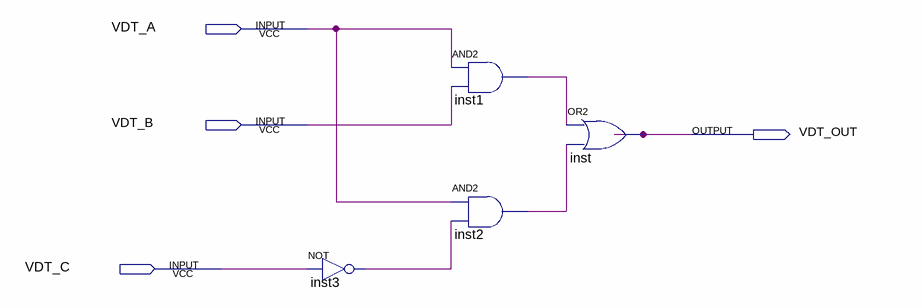
[diagram p0: schematic sheet]
// Quartus schematic assignment2b.bdf as structural Verilog: 4 symbols, 4 pins
module assignment2b (
  input  VDT_A,
  input  VDT_B,
  input  VDT_C,
  output VDT_OUT
);

  wire inst1_out, inst2_out, inst3_out;

  not inst3 (inst3_out, VDT_C);
  and inst1 (inst1_out, VDT_A, VDT_B);
  and inst2 (inst2_out, VDT_A, inst3_out);
  or inst (VDT_OUT, inst1_out, inst2_out);
endmodule
